# Altium schematic sheet Telemetry_canbus.SchDoc: Telemetry CANbus
size A4; Organization: Altium Limited; Address1: L3, 12a Rodborough Rd; Address2: Frenchs Forest; Address3: NSW; Address4: Australia 2086; SheetNumber: 2; SheetTotal: 2
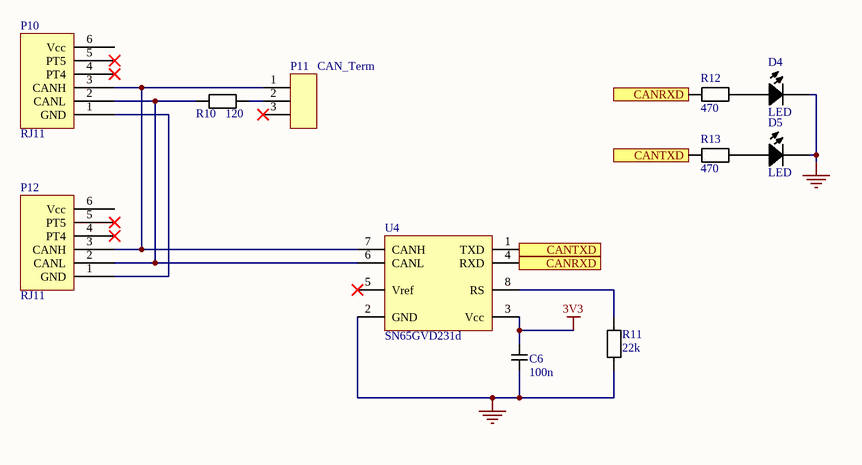
[diagram p0: Telemetry_canbus.SchDoc]

## Parts
C6  value 100n  [C_SMD_0805_pcb]  (hidden comment: SMD)
D4  LED  [D_LED_0805]
D5  LED  [D_LED_0805]
P10  RJ11  [RJ11_Connector]
P11  CAN_Term  [PIN_HEADER_M_1x3]
P12  RJ11  [RJ11_Connector]
R10  value 120  [R_SMD_0805_pcb]  (hidden comment: SMD)
R11  value 22k  [R_SMD_0805_pcb]  (hidden comment: SMD)
R12  value 470  [R_SMD_0805_pcb]  (hidden comment: SMD)
R13  value 470  [R_SMD_0805_pcb]  (hidden comment: SMD)
U4  SN65GVD231d  [SN65HVD231D_SMD]

## Ports
CANRXD, CANRXD (in), CANTXD, CANTXD (out)

## Nets
3V3: C6.1 U4.3(Vcc)
GND: C6.2 D4.2 D5.2 R11.1 U4.2(GND)
CANRXD: R12.1 U4.4(RXD) ; port CANRXD
CANTXD: R13.1 U4.1(TXD) ; port CANTXD
NetD4_1: D4.1 R12.2
NetD5_1: D5.1 R13.2
NetP10_1: P10.1(GND) P12.1(GND)
NetP10_2: P10.2(CANL) P12.2(CANL) R10.1 U4.6(CANL)
NetP10_3: P10.3(CANH) P11.1 P12.3(CANH) U4.7(CANH)
NetP11_2: P11.2 R10.2
NetR11_2: R11.2 U4.8(RS)

Not connected (* = marked no-connect by the designer): P10 4(PT4)* 5(PT5)* 6(Vcc); P11 3*; P12 4(PT4)* 5(PT5)* 6(Vcc); U4 5(Vref)*

## Notes on the sheet
- Title
- Size:
- Date:
- A4
- Number:
- Time:
- Revision:
- Sheet
- of
- File:

## Library data of the parts
C6 = C_SMD_0805: Supplier 1: *; Supplier Part Number 1: *
D4 D5 = D_LED_0805_SMD
P10 P12 = RJ11_Connector: Supplier Part Number 1: *; Supplier 1: *
P11 = PIN_HEADER_M_1x3
R10-R13 = R_SMD_0805: Supplier 1: *; Supplier Part Number 1: *
U4 = SN65HVD231D_SMD: Supplier 1: *; Supplier Part Number 1: *